# Altium schematic sheet MotherBoard_FileInfo.SchDoc
size A; SheetNumber: 2; SheetTotal: 9
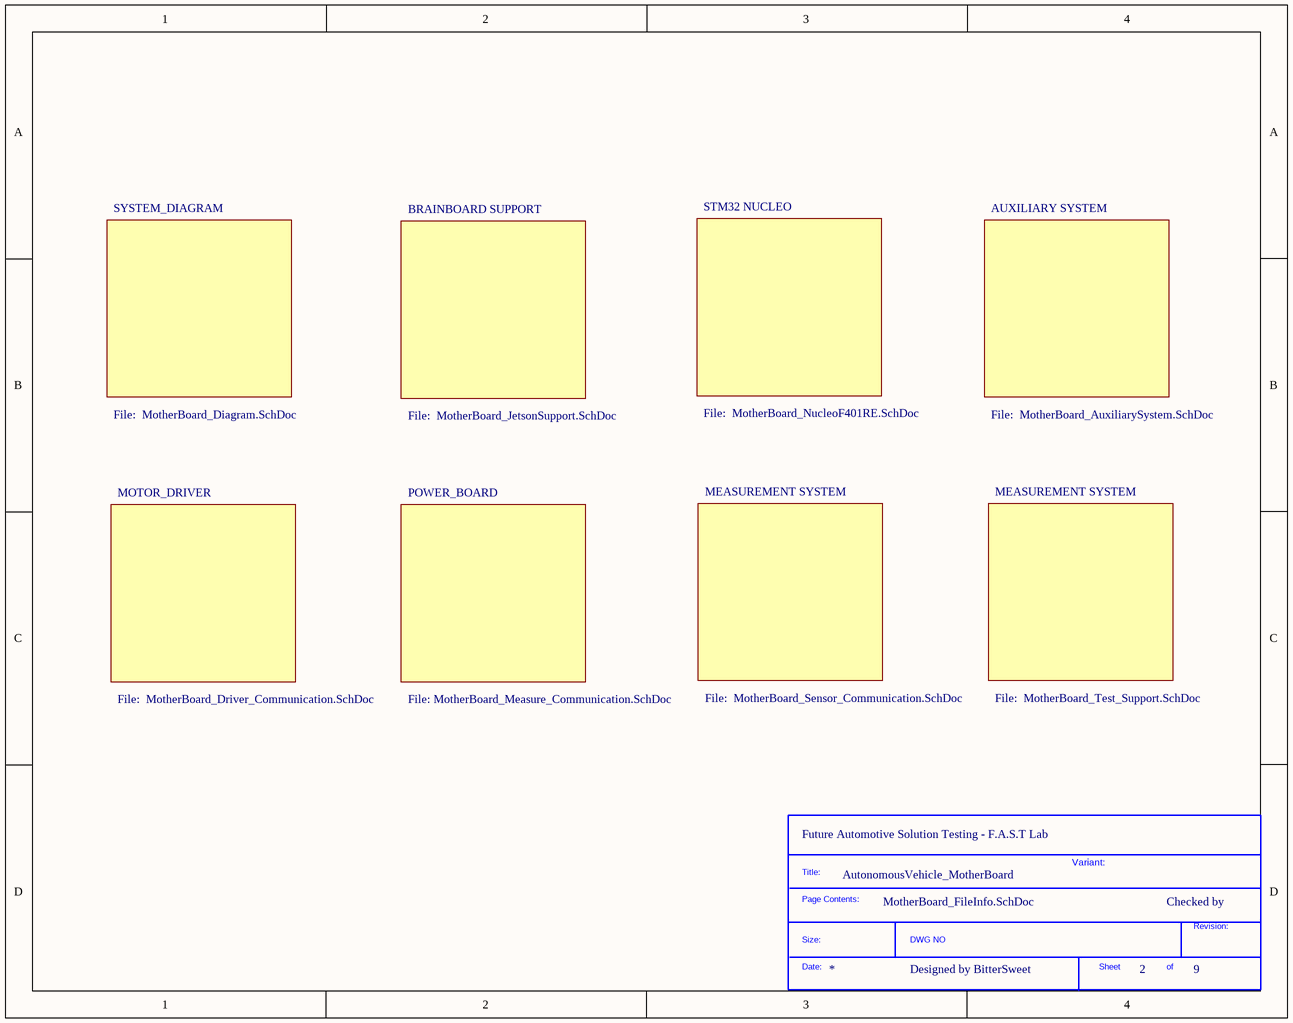
[diagram p0: MotherBoard_FileInfo.SchDoc]

## Parts
*?  SDTitleBlock  (value not drawn)  (graphical)

## Notes on the sheet
- SYSTEM_DIAGRAM
- BRAINBOARD SUPPORT
- STM32 NUCLEO
- AUXILIARY SYSTEM
- File:  MotherBoard_Diagram.SchDoc
- File:  MotherBoard_JetsonSupport.SchDoc
- File:  MotherBoard_NucleoF401RE.SchDoc
- File:  MotherBoard_AuxiliarySystem.SchDoc
- MOTOR_DRIVER
- POWER_BOARD
- MEASUREMENT SYSTEM
- File:  MotherBoard_Driver_Communication.SchDoc
- File: MotherBoard_Measure_Communication.SchDoc
- File:  MotherBoard_Sensor_Communication.SchDoc
- File:  MotherBoard_Test_Support.SchDoc
- (near *?) Future Automotive Solution Testing - F.A.S.T Lab
- AutonomousVehicle_MotherBoard
- Variant:
- Checked by
- Designed by BitterSweet
- (in symbol SDTitleBlock) Title:; Page Contents:; Revision:; Size:; DWG NO; Date:; Sheet; of